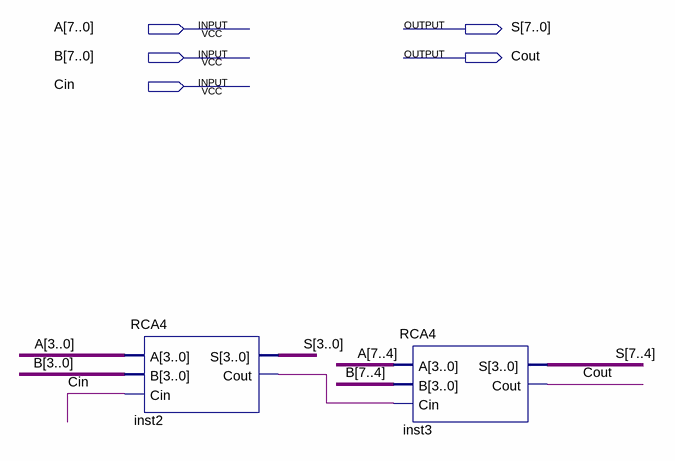
[diagram p0: schematic sheet]
// Quartus schematic RCA8.bdf as structural Verilog: 2 symbols, 5 pins
module RCA8 (
  input  [7:0] A,
  input  [7:0] B,
  input  Cin,
  output [7:0] S,
  output Cout
);

  wire inst2_cout;

  RCA4 inst2 (.A(A[3:0]), .B(B[3:0]), .Cin(Cin), .S(S[3:0]), .Cout(inst2_cout));
  RCA4 inst3 (.A(A[7:4]), .B(B[7:4]), .Cin(inst2_cout), .S(S[7:4]), .Cout(Cout));
endmodule
